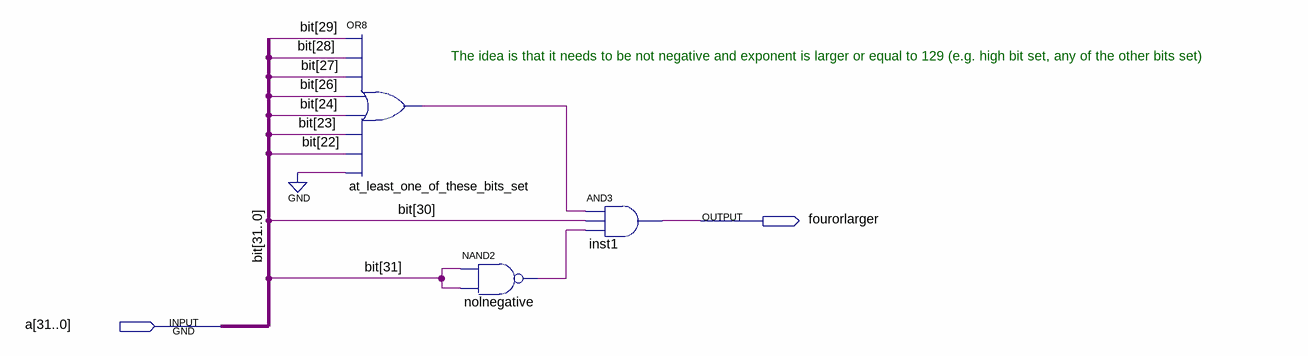
[diagram p0: schematic sheet]
// Quartus schematic floatequaltofourolarger.bdf as structural Verilog: 3 symbols, 2 pins
module floatequaltofourolarger (
  input  [31:0] a,
  output fourorlarger
);

  wire at_least_one_of_these_bits_set_out, nolnegative_out;

  or at_least_one_of_these_bits_set (at_least_one_of_these_bits_set_out, a[29], a[28], a[27], a[26], a[24], a[23], a[22], 1'b0);
  nand nolnegative (nolnegative_out, a[31], a[31]);
  and inst1 (fourorlarger, at_least_one_of_these_bits_set_out, a[30], nolnegative_out);

  // Other names for the same wires on the sheet: bit[31:0] = a

  // Notes on the sheet:
  //   The idea is that it needs to be not negative and exponent is larger or equal to 129 (e.g. high bit set, any of the other bits set)
endmodule
